# EAGLE design Pico Gamepad (EAGLE 9.3.0)
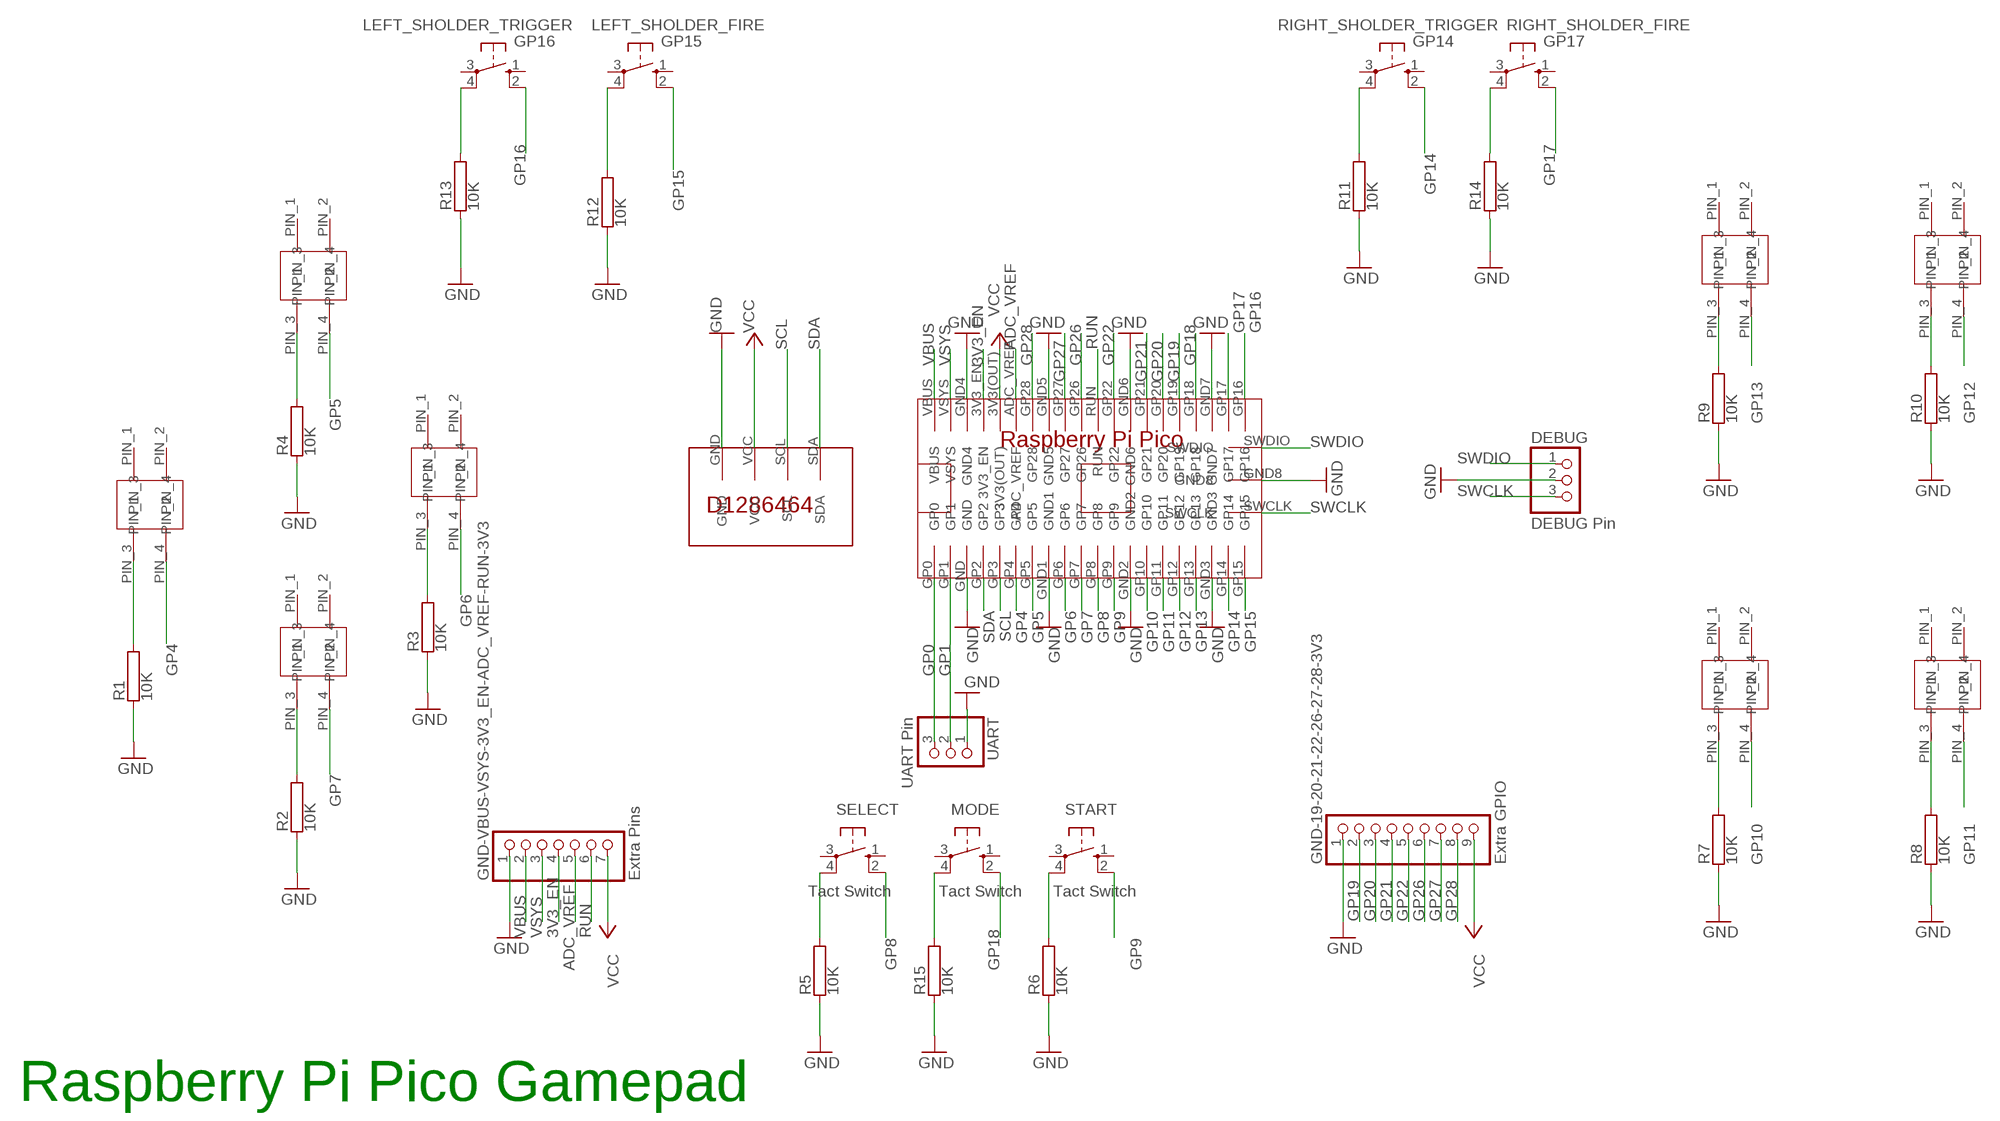
[diagram p0: schematic, sheet 1]

## Parts
A  GAMEPAD_BTN  [GAMEPAD_BTN]
B  GAMEPAD_BTN  [GAMEPAD_BTN]
DEBUG  DEBUG Pin  PINHD-1X3  [1X03]
DOWN  GAMEPAD_BTN  [GAMEPAD_BTN]
GND-19-20-21-22-26-27-28-3V3  Extra GPIO  PINHD-1X9  [1X09]
GND-VBUS-VSYS-3V3_EN-ADC_VREF-RUN-3V3  Extra Pins  PINHD-1X7  [1X07]
LEFT  GAMEPAD_BTN  [GAMEPAD_BTN]
LEFT_SHOLDER_FIRE  GP15  10-XX  [B3F-10XX]
LEFT_SHOLDER_TRIGGER  GP16  10-XX  [B3F-10XX]
MODE  Tact Switch  10-XX  [B3F-10XX]
R1  10K  RRS1/8  [RS1/8]
R2  10K  RRS1/8  [RS1/8]
R3  10K  RRS1/8  [RS1/8]
R4  10K  RRS1/8  [RS1/8]
R5  10K  RRS1/8  [RS1/8]
R6  10K  RRS1/8  [RS1/8]
R7  10K  RRS1/8  [RS1/8]
R8  10K  RRS1/8  [RS1/8]
R9  10K  RRS1/8  [RS1/8]
R10  10K  RRS1/8  [RS1/8]
R11  10K  RRS1/8  [RS1/8]
R12  10K  RRS1/8  [RS1/8]
R13  10K  RRS1/8  [RS1/8]
R14  10K  RRS1/8  [RS1/8]
R15  10K  RRS1/8  [RS1/8]
RIGHT  GAMEPAD_BTN  [GAMEPAD_BTN]
RIGHT_SHOLDER_FIRE  GP17  10-XX  [B3F-10XX]
RIGHT_SHOLDER_TRIGGER  GP14  10-XX  [B3F-10XX]
SELECT  Tact Switch  10-XX  [B3F-10XX]
START  Tact Switch  10-XX  [B3F-10XX]
U$1  RASPBERRYPIPICO  [RASPBERRYPIPICO]
U$2  OLED_DISPLAY  [OLED_DISPLAY]
UART  UART Pin  PINHD-1X3  [1X03]
UP  GAMEPAD_BTN  [GAMEPAD_BTN]
X  GAMEPAD_BTN  [GAMEPAD_BTN]
Y  GAMEPAD_BTN  [GAMEPAD_BTN]

## Nets
3V3_EN: GND-VBUS-VSYS-3V3_EN-ADC_VREF-RUN-3V3.4 U$1.3V3_EN
ADC_VREF: GND-VBUS-VSYS-3V3_EN-ADC_VREF-RUN-3V3.5 U$1.ADC_VREF
GND: DEBUG.2 GND-19-20-21-22-26-27-28-3V3.1 GND-VBUS-VSYS-3V3_EN-ADC_VREF-RUN-3V3.1 R1.1 R2.1 R3.1 R4.1 R5.1 R6.1 R7.1 R8.1 R9.1 R10.1 R11.1 R12.1 R13.1 R14.1 R15.1 U$1.GND U$1.GND1 U$1.GND2 U$1.GND3 U$1.GND4 U$1.GND5 U$1.GND6 U$1.GND7 U$1.GND8 U$2.GND UART.1
GP0: U$1.GP0 UART.3
GP1: U$1.GP1 UART.2
GP4: LEFT.PIN_4 U$1.GP4
GP5: U$1.GP5 UP.PIN_4
GP6: RIGHT.PIN_4 U$1.GP6
GP7: DOWN.PIN_4 U$1.GP7
GP8: SELECT.2(S1) U$1.GP8
GP9: START.2(S1) U$1.GP9
GP10: A.PIN_4 U$1.GP10
GP11: B.PIN_4 U$1.GP11
GP12: U$1.GP12 Y.PIN_4
GP13: U$1.GP13 X.PIN_4
GP14: RIGHT_SHOLDER_TRIGGER.2(S1) U$1.GP14
GP15: LEFT_SHOLDER_FIRE.2(S1) U$1.GP15
GP16: LEFT_SHOLDER_TRIGGER.2(S1) U$1.GP16
GP17: RIGHT_SHOLDER_FIRE.2(S1) U$1.GP17
GP18: MODE.2(S1) U$1.GP18
GP19: GND-19-20-21-22-26-27-28-3V3.2 U$1.GP19
GP20: GND-19-20-21-22-26-27-28-3V3.3 U$1.GP20
GP21: GND-19-20-21-22-26-27-28-3V3.4 U$1.GP21
GP22: GND-19-20-21-22-26-27-28-3V3.5 U$1.GP22
GP26: GND-19-20-21-22-26-27-28-3V3.6 U$1.GP26
GP27: GND-19-20-21-22-26-27-28-3V3.7 U$1.GP27
GP28: GND-19-20-21-22-26-27-28-3V3.8 U$1.GP28
N$1: R9.2 X.PIN_3
N$2: R10.2 Y.PIN_3
N$3: R11.2 RIGHT_SHOLDER_TRIGGER.4(P1)
N$4: LEFT_SHOLDER_FIRE.4(P1) R12.2
N$5: R4.2 UP.PIN_3
N$6: LEFT.PIN_3 R1.2
N$7: DOWN.PIN_3 R2.2
N$8: R3.2 RIGHT.PIN_3
N$9: MODE.4(P1) R15.2
N$10: R5.2 SELECT.4(P1)
N$11: R6.2 START.4(P1)
N$12: A.PIN_3 R7.2
N$13: B.PIN_3 R8.2
N$14: LEFT_SHOLDER_TRIGGER.4(P1) R13.2
N$16: R14.2 RIGHT_SHOLDER_FIRE.4(P1)
RUN: GND-VBUS-VSYS-3V3_EN-ADC_VREF-RUN-3V3.6 U$1.RUN
SCL: U$1.GP3 U$2.SCL
SDA: U$1.GP2 U$2.SDA
SWCLK: DEBUG.3 U$1.SWCLK
SWDIO: DEBUG.1 U$1.SWDIO
VBUS: GND-VBUS-VSYS-3V3_EN-ADC_VREF-RUN-3V3.2 U$1.VBUS
VCC: GND-19-20-21-22-26-27-28-3V3.9 GND-VBUS-VSYS-3V3_EN-ADC_VREF-RUN-3V3.7 U$1.3V3(OUT) U$2.VCC
VSYS: GND-VBUS-VSYS-3V3_EN-ADC_VREF-RUN-3V3.3 U$1.VSYS
Unconnected: A.PIN_1 A.PIN_2 B.PIN_1 B.PIN_2 DOWN.PIN_1 DOWN.PIN_2 LEFT.PIN_1 LEFT.PIN_2 LEFT_SHOLDER_FIRE.1(S) LEFT_SHOLDER_FIRE.3(P) LEFT_SHOLDER_TRIGGER.1(S) LEFT_SHOLDER_TRIGGER.3(P) MODE.1(S) MODE.3(P) RIGHT.PIN_1 RIGHT.PIN_2 RIGHT_SHOLDER_FIRE.1(S) RIGHT_SHOLDER_FIRE.3(P) RIGHT_SHOLDER_TRIGGER.1(S) RIGHT_SHOLDER_TRIGGER.3(P) SELECT.1(S) SELECT.3(P) START.1(S) START.3(P) UP.PIN_1 UP.PIN_2 X.PIN_1 X.PIN_2 Y.PIN_1 Y.PIN_2

## Notes on the sheet
- Raspberry Pi Pico Gamepad

## Library data of the parts
A B DOWN LEFT RIGHT UP X Y = gamepad_btn:GAMEPAD_BTN
DEBUG UART = pinhead:PINHD-1X3: PIN HEADER
GND-19-20-21-22-26-27-28-3V3 = pinhead:PINHD-1X9: PIN HEADER
GND-VBUS-VSYS-3V3_EN-ADC_VREF-RUN-3V3 = pinhead:PINHD-1X7: PIN HEADER
LEFT_SHOLDER_FIRE LEFT_SHOLDER_TRIGGER MODE RIGHT_SHOLDER_FIRE RIGHT_SHOLDER_TRIGGER SELECT START = switch-omron:10-XX: OMRON SWITCH; MPN: B3F-1000; OC_FARNELL: 176432; OC_NEWARK: 36M3542
R1-R15 = resistor-power:R: Power Resitor; OC_FARNELL: unknown; OC_NEWARK: unknown
U$1 = raspberrypi_pico:RASPBERRYPIPICO
U$2 = oled_display:OLED_DISPLAY

## Board
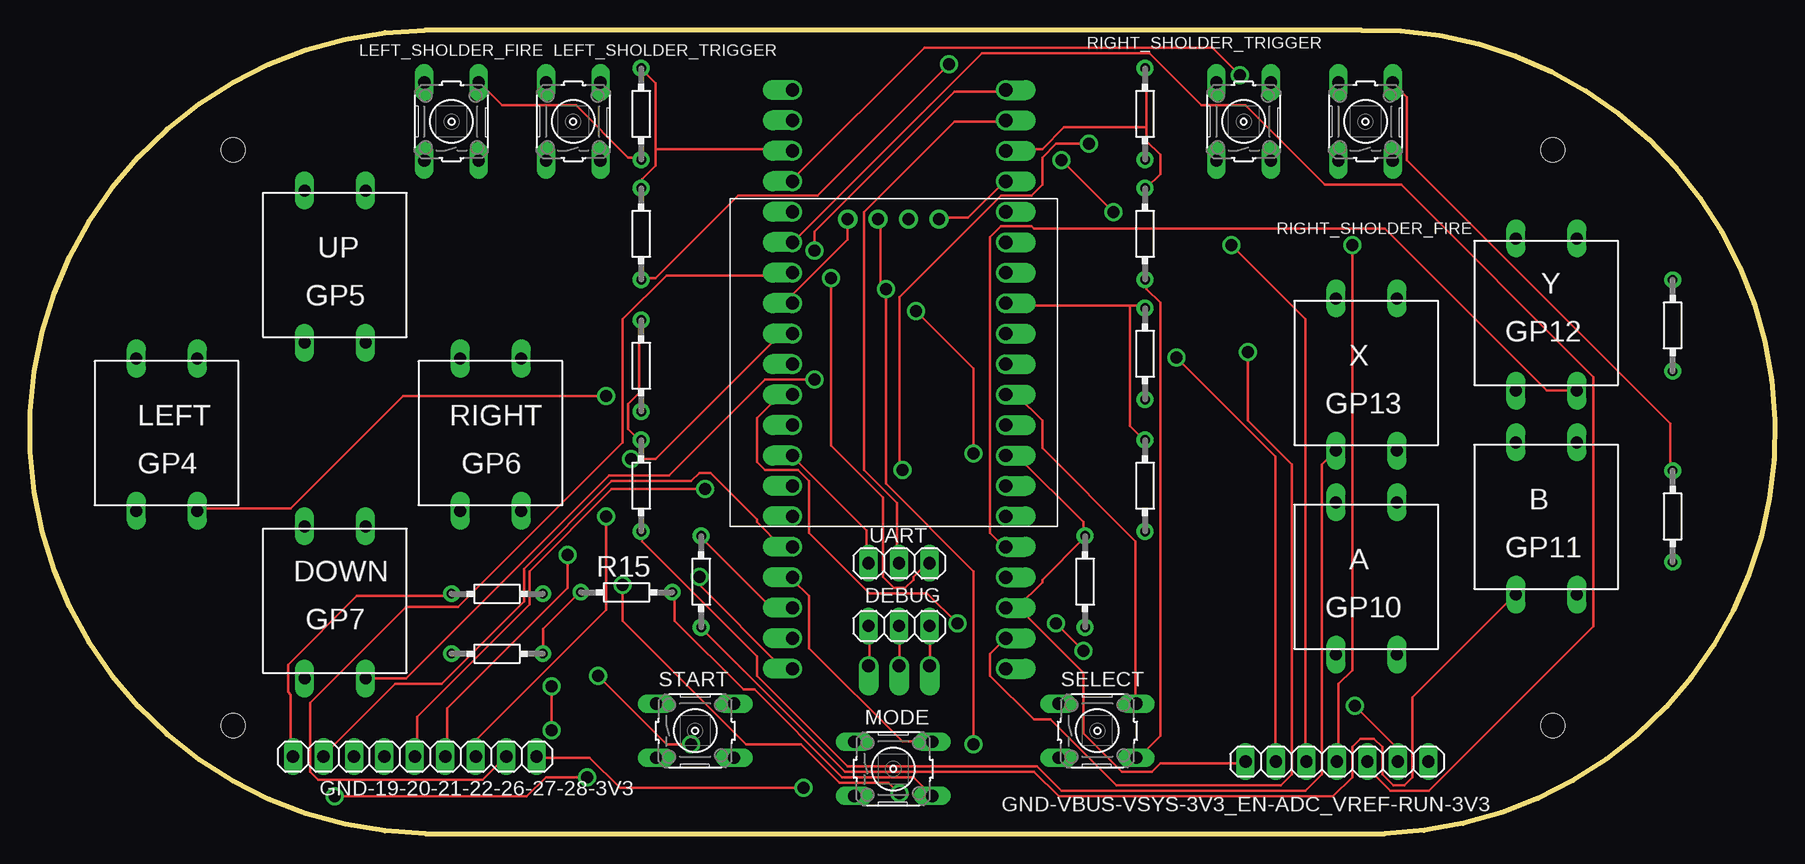
[diagram p1: board, top side]
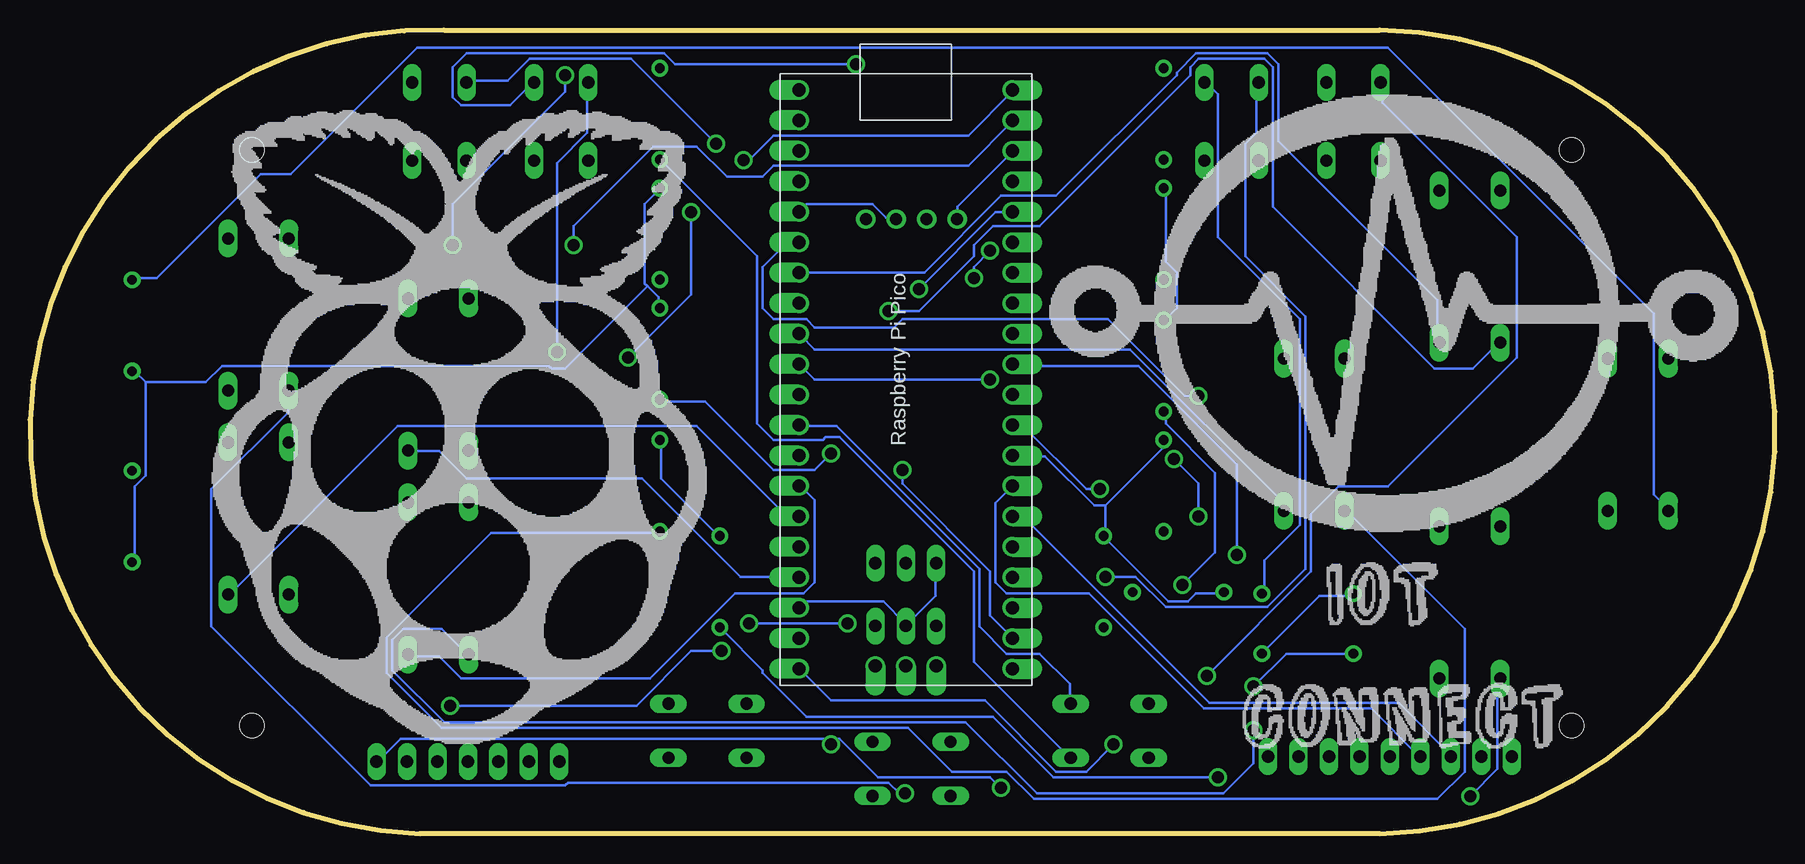
[diagram p2: board, bottom side, seen from below]

Size 145.45 x 67 mm. Coordinates in mm from the lower left corner, seen from the top.
Outline: 32.95,0 112.95,0 arc180 110.95,67 32.95,67 arc178 32.95,0
Copper layers (1*16): Top 0.035mm / dielectric 1.5mm / Bottom 0.035mm
Design rules "default *": minimum track width 8mil, minimum drill 1mm, track to track 10mil, track to pad 10mil, pad to pad 10mil, via to via 12mil, smd to smd 6mil, copper to edge 40mil, drill to drill 12mil, minimum pad ring 10mil, minimum via ring 8mil, stop-mask expansion 4mil, vias tented up to drill 0mil, thermal gap 10mil
Holes 2 mm at 126.95,57 16.95,57 16.95,9 126.95,9

### Footprints (pad centres in the part's own frame; a part is rotated, then mirrored left to right if it is on the bottom)
GAMEPAD_BTN = drill 1 pad 1.6 long: PIN_1 -2.08,7.62; PIN_2 3,7.62; PIN_3 -2.08,-5.08; PIN_4 3,-5.08
1X03 = drill 1.016 long: 1 -2.54,0; 2 0,0; 3 2.54,0
1X09 = drill 1.016 long: 1 -10.16,0; 2 -7.62,0; 3 -5.08,0; 4 -2.54,0; 5 0,0; 6 2.54,0; 7 5.08,0; 8 7.62,0; 9 10.16,0
1X07 = drill 1.016 long: 1 -7.62,0; 2 -5.08,0; 3 -2.54,0; 4 0,0; 5 2.54,0; 6 5.08,0; 7 7.62,0
B3F-10XX = drill 1.016 long: 1 -3.251,2.261; 2 3.251,2.261; 3 -3.251,-2.261; 4 3.251,-2.261
RS1/8 = drill 0.8 pad 1.4: 1 -3.81,0; 2 3.81,0
RASPBERRYPIPICO = drill 1.1 pad 1.6 offset: 3V3(OUT) 10.16,17.78; 3V3_EN 7.62,17.78; ADC_VREF 12.7,17.78; GND 5.08,0; GND1 17.78,0; GND2 30.48,0; GND3 43.18,0; GND4 5.08,17.78; GND5 17.78,17.78; GND6 30.48,17.78; GND7 43.18,17.78; GND8 48.03,8.89; GP0 0,0; GP1 2.54,0; GP2 7.62,0; GP3 10.16,0; GP4 12.7,0; GP5 15.24,0; GP6 20.32,0; GP7 22.86,0; GP8 25.4,0; GP9 27.94,0; GP10 33.02,0; GP11 35.56,0; GP12 38.1,0; GP13 40.64,0; GP14 45.72,0; GP15 48.26,0; GP16 48.26,17.78; GP17 45.72,17.78; GP18 40.64,17.78; GP19 38.1,17.78; GP20 35.56,17.78; GP21 33.02,17.78; GP22 27.94,17.78; GP26 22.86,17.78; GP27 20.32,17.78; GP28 15.24,17.78; RUN 25.4,17.78; SWCLK 48.03,6.35; SWDIO 48.03,11.43; VBUS 0,17.78; VSYS 2.54,17.78
OLED_DISPLAY = drill 1.001 pad 1.6: GND -3.8,12.2; SCL 1.28,12.2; SDA 3.82,12.2; VCC -1.26,12.2

### Placement (x,y rotation side)
A  110.95,20 0 top
B  125.95,25 0 top
DEBUG  72.45,17.3 0 top
DOWN  24.97,18 0 top
GND-19-20-21-22-26-27-28-3V3  32.08,6.41 0 top
GND-VBUS-VSYS-3V3_EN-ADC_VREF-RUN-3V3  108.95,6 0 top
LEFT  10.95,31.99 0 top
LEFT_SHOLDER_FIRE  35.13,59.37 90 top
LEFT_SHOLDER_TRIGGER  45.29,59.37 90 top
MODE  71.96,5.39 0 top
R1  136.93,42.36 90 top
R2  87.95,21 270 top
R3  92.95,29 270 top
R4  92.95,40 270 top
R5  92.95,50 270 top
R6  92.95,60 270 top
R7  38.95,15 180 top
R8  55.95,21 270 top
R9  50.95,29 270 top
R10  50.95,39 270 top
R11  50.95,50 270 top
R12  50.95,60 270 top
R13  38.95,20 0 top
R14  136.93,26.44 90 top
R15  49.73,20.12 0 top
RIGHT  37.95,31.99 0 top
RIGHT_SHOLDER_FIRE  111.33,59.37 90 top
RIGHT_SHOLDER_TRIGGER  101.17,59.37 90 top
SELECT  88.98,8.57 0 top
START  55.45,8.57 0 top
U$1  81.34,62 270 bottom
U$2  71.96,39.02 0 top
UART  72.45,22.54 0 top
UP  24.97,46 0 top
X  110.95,37 0 top
Y  125.95,42 0 top

### Tracks (layer width: path | path; a pad name or v marks a point on that pad's centre or on a via)
3V3_EN  (via drill 1)
  Top 0.203: v110.21,49.06 110.21,13.62 109.07,12.48 109.07,6.08 GND-VBUS-VSYS-3V3_EN-ADC_VREF-RUN-3V3.4 | v100.84,63.23 98.55,65.51 74.55,65.51 63.58,54.54 U$1.3V3_EN
  Bottom 0.203: v110.21,49.06 110.21,52.48 100.84,61.86 v100.84,63.23
ADC_VREF
  Top 0.203: GND-VBUS-VSYS-3V3_EN-ADC_VREF-RUN-3V3.5 111.58,5.85 111.58,5.39 113.41,3.56 116.61,3.56 130.33,17.28 130.33,38.08 114.33,54.08 107.92,54.08 101.3,60.71 97.64,60.71 93.29,65.06 79.35,65.06 63.58,49.28 U$1.ADC_VREF
GND
  Top 0.203: 93.07,58.88 93.07,57.74 94.21,56.6 94.21,55 93.07,53.86 R5.1 | 93.07,58.88 93.07,63.69 R6.1 | 91.69,44.03 92.84,44.03 R4.1 | 91.69,44.03 81.41,44.03 U$1.GND1 | 93.07,58.88 86.21,58.88 84.38,57.06 81.41,57.06 U$1.GND | R7.1 42.77,15.22 42.77,17.05 45.75,20.02 R15.1 | GND-19-20-21-22-26-27-28-3V3.1 21.74,6.54 21.74,11.56 21.51,11.79 21.51,14.08 27.23,19.79 35,19.79 R13.1 | 52.15,57.06 52.15,62.54 51,63.69 R12.1 | 52.15,57.06 52.15,55.68 51,54.54 51,53.86 R11.1 | U$1.GND5 63.58,44.25 63.58,44.94 68.15,49.51 68.15,51.11 U$2.GND | 52.15,57.06 63.35,57.06 U$1.GND4 | R10.1 50.77,42.65 50.77,36.71 49.86,35.8 49.86,33.74 50.77,32.82 R9.1 | U$1.GND7 63.35,18.88 61.75,18.88 56.03,24.59 R8.1 | DEBUG.2 72.49,17.28 72.49,14.08 U$1.GND8 | 82.32,18.88 84.38,20.94 84.38,21.17 87.81,24.59 R2.1 87.81,24.82 87.81,25.97 82.32,31.45 81.41,31.45 U$1.GND2 | 82.32,18.88 81.41,18.88 U$1.GND3 82.32,18.88 | 82.32,18.88 87.81,13.39 87.81,8.36 91.01,5.16 93.52,5.16 94.21,5.85 101.3,5.85 GND-VBUS-VSYS-3V3_EN-ADC_VREF-RUN-3V3.1 | U$1.GND6 63.58,31.45 69.75,25.28 69.75,22.54 UART.1 | 91.69,44.03 91.69,33.97 92.84,32.82 R3.1
  Bottom 0.203: 135.81,37.63 135.81,29.85 136.73,28.94 136.73,22.77 R14.1 | 135.81,37.63 136.73,38.54 R1.1 | 93.98,45.63 94.21,45.85 94.21,52.48 93.07,53.63 R5.1 | 93.98,45.63 93.07,44.71 93.07,44.03 R4.1 | 135.81,37.63 130.78,37.63 129.41,39 102.21,39 101.98,38.77 100.84,38.77 93.98,45.63 | R13.1 35.23,19.79 37.97,19.79 42.55,15.22 R7.1 | U$2.GND 68.15,51.34 68.15,52.26 63.58,56.83 U$1.GND4 | 55.8,27.34 55.8,24.82 R8.1 55.8,24.59 50.55,19.34 48.95,19.34 48.26,20.02 45.97,20.02 R15.1 | 55.8,27.34 51,32.14 51,32.6 R9.1 | 55.8,27.34 56.72,27.34 60.83,31.45 63.35,31.45 U$1.GND6 | UART.1 69.98,22.54 69.98,19.79 72.26,17.51 DEBUG.2 72.49,17.51 74.32,19.34 80.72,19.34 81.18,18.88 U$1.GND3 | R3.1 92.84,32.6 92.84,29.62 88.04,24.82 R2.1 | R11.1 50.77,53.63 50.77,47.68 49.86,46.77 49.86,43.8 50.77,42.88 R10.1
GP0  (via drill 1)
  Top 0.203: v66.78,46.31 66.78,32.37 71.12,28.02 71.12,21.39 72.03,20.48 72.95,20.48 73.63,21.17 73.63,21.39 74.78,22.54 UART.3 | v65.41,48.6 65.41,50.2 77.06,61.86 81.18,61.86 U$1.GP0
  Bottom 0.203: v66.78,46.31 66.78,47.23 v65.41,48.6
GP1
  Top 0.203: UART.2 72.26,22.54 72.26,27.57 69.52,30.31 69.52,51.8 77.06,59.34 81.18,59.34 U$1.GP1
GP4  (via drill 1)
  Top 0.203: v48.03,36.48 31.12,36.48 21.74,27.11 13.97,27.11 LEFT.PIN_4
  Bottom 0.203: v48.03,36.48 49.17,36.48 55.58,42.88 72.72,42.88 73.41,42.2 80.04,42.2 80.72,42.88 83.46,42.88 84.38,43.8 84.38,47.23 82.32,49.28 81.41,49.28 U$1.GP4
GP5
  Bottom 0.203: UP.PIN_4 28.14,41.05 28.14,44.48 41.4,57.74 41.4,64.14 42.32,65.06 48.26,65.06 49.86,63.46 49.86,63.23 59.92,53.17 64.49,53.17 70.89,46.77 81.18,46.77 U$1.GP5
GP6
  Bottom 0.203: RIGHT.PIN_4 41.17,27.11 41.17,27.8 53.75,40.37 80.04,40.37 81.18,41.51 U$1.GP6
GP7  (via drill 1)
  Top 0.203: v65.41,37.85 61.29,37.85 53.29,29.85 48.26,29.85 31.34,12.94 28.14,12.94 DOWN.PIN_4
  Bottom 0.203: v65.41,37.85 80.04,37.85 81.18,39 U$1.GP7
GP8
  Top 0.203: SELECT.2 92.15,10.88 92.15,24.37 84.38,32.14 84.38,34.42 82.32,36.48 81.41,36.48 U$1.GP8
GP9
  Bottom 0.203: START.2 58.78,10.88 58.78,12.48 61.29,14.99 64.03,14.99 66.32,17.28 66.32,22.08 78.21,33.97 81.18,33.97 U$1.GP9
GP10
  Bottom 0.203: A.PIN_4 113.87,14.77 111.35,14.77 109.53,12.94 93.75,12.94 86.67,20.02 80.95,20.02 80.04,20.94 80.04,27.8 81.18,28.94 U$1.GP10
GP11
  Bottom 0.203: B.PIN_4 128.73,20.02 114.78,33.97 89.87,33.97 82.55,26.65 81.41,26.65 U$1.GP11
GP12
  Top 0.203: Y.PIN_4 128.73,36.94 126.44,36.94 112.95,50.43 83.69,50.43 83.46,50.66 80.95,50.66 80.04,49.74 80.04,25.05 81.18,23.91 U$1.GP12
GP13
  Bottom 0.203: X.PIN_4 113.87,31.91 111.35,31.91 109.07,29.62 94.44,29.62 86.21,21.39 81.41,21.39 U$1.GP13
GP14  (via drill 1)
  Top 0.203: v101.52,40.14 101.52,34.42 105.18,30.77 105.18,4.94 104.27,4.02 90.55,4.02 85.06,9.51 83.69,9.51 80.04,13.16 80.04,14.99 81.18,16.14 U$1.GP14
  Bottom 0.203: v101.52,40.14 101.52,55.91 99.01,58.43 99.01,62.54 RIGHT_SHOLDER_TRIGGER.2
GP15  (via drill 1)
  Top 0.203: v47.35,13.16 53.06,7.45 v55.12,7.45
  Bottom 0.203: v47.35,13.16 38.66,21.85 38.66,26.65 36.37,28.94 32.26,28.94 21.51,39.68 21.51,49.74 32.72,60.94 32.72,62.54 LEFT_SHOLDER_FIRE.2 | v55.12,7.45 57.4,5.16 59.92,5.16 65.86,11.11 78.66,11.11 81.18,13.62 U$1.GP15
GP16  (via drill 1)
  Top 0.203: v55.8,21.39 55.8,20.71 62.66,13.85 63.35,13.85 U$1.GP16
  Bottom 0.203: v55.8,21.39 53.29,21.39 50.77,18.88 42.32,18.88 39.12,22.08 39.12,43.11 44.15,48.14 44.15,57.51 43.23,58.43 43.23,62.54 LEFT_SHOLDER_TRIGGER.2
GP17  (via drill 1)
  Top 0.203: v88.27,57.51 85.52,57.51 84.38,56.37 84.38,54.08 83.46,53.17 80.95,53.17 72.49,44.71 72.49,30.54 v72.72,30.31
  Bottom 0.203: v88.27,57.51 95.35,64.6 103.81,64.6 105.64,62.77 109.07,62.77 RIGHT_SHOLDER_FIRE.2 | v72.72,30.31 72.72,29.17 65.41,21.85 65.41,18.19 63.58,16.37 U$1.GP17
GP18
  Top 0.203: MODE.2 75.01,7.68 72.72,7.68 64.95,15.45 64.95,19.79 63.58,21.17 U$1.GP18
GP19
  Top 0.203: GND-19-20-21-22-26-27-28-3V3.2 24.49,6.54 30.43,12.48 34.32,12.48 41.17,19.34 41.17,22.08 48.49,29.4 55.12,29.4 55.8,30.08 56.72,30.08 60.6,26.2 60.6,25.97 62.66,23.91 63.35,23.91 U$1.GP19
GP20
  Bottom 0.203: GND-19-20-21-22-26-27-28-3V3.3 27,6.54 31.34,10.88 47.12,10.88 62.66,26.42 63.35,26.42 U$1.GP20
GP21
  Bottom 0.203: GND-19-20-21-22-26-27-28-3V3.4 29.74,6.54 33.63,10.42 47.57,10.42 57.18,20.02 64.03,20.02 64.95,20.94 64.95,27.57 63.58,28.94 U$1.GP21
GP22  (via drill 1)
  Top 0.203: v56.26,28.71 48.49,28.71 41.63,21.85 41.63,19.11 32.26,9.74 32.26,6.54 GND-19-20-21-22-26-27-28-3V3.5
  Bottom 0.203: v56.26,28.71 57.4,28.71 62.66,33.97 63.35,33.97 U$1.GP22
GP26  (via drill 1)
  Top 0.203: v44.83,23.22 44.83,20.48 34.77,10.42 34.77,6.54 GND-19-20-21-22-26-27-28-3V3.6
  Bottom 0.203: v44.83,23.22 44.83,30.77 53.06,39 63.35,39 U$1.GP26
GP27  (via drill 1)
  Top 0.203: v48.03,26.42 48.03,18.65 37.29,7.91 37.29,6.54 GND-19-20-21-22-26-27-28-3V3.7 | v50.09,31.22 52.15,31.22 62.43,41.51 63.35,41.51 U$1.GP27
  Bottom 0.203: v48.03,26.42 48.03,29.17 v50.09,31.22
GP28
  Top 0.203: GND-19-20-21-22-26-27-28-3V3.8 39.57,6.31 37.74,4.48 24.03,4.48 23.34,5.16 23.34,10.88 31.34,18.88 35.69,18.88 49.4,32.6 49.4,42.88 53.06,46.54 63.35,46.54 U$1.GP28
N$1
  Top 0.203: R9.2 51,25.05 51,24.37 60.6,14.77 60.6,13.16 68.15,5.62 83.92,5.62 85.98,3.56 106.32,3.56 107.7,4.94 107.7,30.77 108.84,31.91 X.PIN_3
N$2  (via drill 1)
  Top 0.203: v49.4,20.71 49.4,17.74 59.69,7.45 64.26,7.45 67.46,4.25 71.58,4.25 v72.49,3.34
  Bottom 0.203: v49.4,20.71 46.66,23.45 46.66,30.08 50.77,34.2 50.77,35.11 R10.2 | v72.49,3.34 72.95,3.34 73.86,4.25 100.61,4.25 100.84,4.02 117.07,4.02 130.33,17.28 130.33,28.71 123.93,35.11 123.93,36.71 Y.PIN_3
N$3  (via drill 1)
  Top 0.203: v76.61,64.14 65.63,53.17 59,53.17 52.15,46.31 51,46.31 R11.2
  Bottom 0.203: v76.61,64.14 91.69,64.14 92.61,65.06 109.07,65.06 110.21,63.91 110.21,61.4 109.53,60.71 105.41,60.71 103.58,62.54 RIGHT_SHOLDER_TRIGGER.4
N$4
  Top 0.203: R12.2 50.77,56.37 49.86,56.37 45.52,60.71 39.34,60.71 37.52,62.54 LEFT_SHOLDER_FIRE.4
N$5  (via drill 1)
  Top 0.203: v78.66,31.68 78.66,38.77 v73.86,43.57
  Bottom 0.203: v78.66,31.68 80.04,30.31 83.46,30.31 89.18,36.02 92.84,36.02 R4.2 | v73.86,43.57 71.35,43.57 66.78,48.14 66.78,49.06 65.18,50.66 61.29,50.66 48.72,63.23 48.72,63.91 48.03,64.6 42.55,64.6 41.86,63.91 41.86,52.26 28.37,38.77 25.17,38.77 23.11,40.83 UP.PIN_3
N$6
  Bottom 0.203: R1.2 136.73,46.31 134.9,46.31 126.21,55 123.7,55 113.18,65.51 32.26,65.51 10.08,43.34 10.08,28.25 8.94,27.11 LEFT.PIN_3
N$7  (via drill 1)
  Top 0.203: v46.43,4.71 43,4.71 41.4,3.11 v25.4,3.11
  Bottom 0.203: v46.43,4.71 60.15,4.71 65.18,9.74 80.72,9.74 84.38,13.39 84.38,13.62 87.81,17.05 R2.2 | v25.4,3.11 23.11,5.39 23.11,12.71 DOWN.PIN_3
N$8
  Bottom 0.203: R3.2 93.07,25.05 107.01,25.05 115.7,16.37 115.7,13.39 111.13,8.82 72.26,8.82 68.61,5.16 64.03,5.16 61.75,2.88 28.14,2.88 25.86,5.16 25.86,17.05 35.69,26.88 RIGHT.PIN_3
N$9
  Top 0.203: MODE.4 73.63,4.71 67.69,4.71 60.38,12.02 59.46,12.02 53.75,17.74 53.75,20.02 R15.2
N$10
  Top 0.203: R5.2 93.07,46.08 93.07,45.4 94.21,44.25 94.21,8.14 92.38,6.31 SELECT.4
N$11
  Bottom 0.203: R6.2 92.84,56.14 84.84,48.14 84.84,34.2 83.46,32.82 79.35,32.82 79.12,33.05 77.98,33.05 66.78,21.85 66.78,14.31 58.78,6.31 START.4
N$12  (via drill 1)
  Top 0.203: v43.46,8.59 v43.46,12.25
  Bottom 0.203: v43.46,12.25 40.72,14.99 35.23,14.99 R7.2 | v43.46,8.59 43.46,5.85 45.97,3.34 61.52,3.34 67.46,9.28 110.9,9.28 115.24,13.62 115.24,16.14 114.33,17.05 111.13,17.05 109.07,14.99 A.PIN_3
N$13
  Top 0.203: R8.2 56.03,17.05 67.92,5.16 83.69,5.16 85.75,3.11 108.61,3.11 110.21,4.71 110.21,7.22 110.9,7.91 112.04,7.91 112.73,7.22 112.73,4.94 113.64,4.02 114.55,4.02 115.24,4.71 115.24,11.34 123.7,19.79 B.PIN_3
N$14
  Bottom 0.203: R13.2 42.55,20.02 42.55,22.77 39.57,25.74 39.57,42.88 46.43,49.74 46.43,61.63 47.35,62.54 LEFT_SHOLDER_TRIGGER.4
N$16
  Top 0.203: R14.2 136.73,30.31 136.73,34.2 114.78,56.14 114.78,61.4 113.64,62.54 RIGHT_SHOLDER_FIRE.4
RUN  (via drill 1)
  Top 0.203: v110.44,10.65 113.87,7.22 113.87,6.08 GND-VBUS-VSYS-3V3_EN-ADC_VREF-RUN-3V3.6 | v85.52,17.51 v87.81,15.22 | v77.29,17.51 74.78,20.02 69.98,20.02 64.95,25.05 64.95,29.4 64.03,30.31 61.29,30.31 60.6,31 60.6,34.65 62.43,36.48 63.35,36.48 U$1.RUN
  Bottom 0.203: v110.44,10.65 94.89,10.65 90.32,15.22 v87.81,15.22 | v77.29,17.51 v85.52,17.51
SCL
  Bottom 0.203: U$2.SCL 73.41,51.34 74.09,51.34 75.24,52.48 80.72,52.48 81.18,52.03 U$1.GP3
SDA
  Top 0.203: U$2.SDA 75.92,51.34 78.21,51.34 81.18,54.31 U$1.GP2
SWCLK
  Top 0.203: DEBUG.3 75.01,17.28 75.01,14.08 U$1.SWCLK
SWDIO
  Top 0.203: DEBUG.1 69.98,17.28 69.98,14.08 U$1.SWDIO
VBUS  (via drill 1)
  Top 0.203: v95.58,39.68 103.81,31.45 103.81,6.08 GND-VBUS-VSYS-3V3_EN-ADC_VREF-RUN-3V3.2 | v85.98,56.14 v90.32,51.8
  Bottom 0.203: v95.58,39.68 90.32,44.94 v90.32,51.8 | v85.98,56.14 85.52,56.14 83.46,58.2 67.23,58.2 63.58,61.86 U$1.VBUS
VCC  (via drill 1)
  Top 0.203: U$2.VCC 70.89,51.11 70.89,45.85 v71.35,45.4 71.35,29.17 78.66,21.85 v78.66,7.45 | v64.49,3.79 49.17,3.79 46.66,6.31 42.32,6.31 GND-19-20-21-22-26-27-28-3V3.9
  Bottom 0.203: v71.35,45.4 64.95,51.8 63.58,51.8 U$1.3V3(OUT) | 78.66,7.91 77.98,7.91 74.78,4.71 65.41,4.71 v64.49,3.79 | 78.66,7.91 114.55,7.91 116.38,6.08 GND-VBUS-VSYS-3V3_EN-ADC_VREF-RUN-3V3.7 | 78.66,7.91 v78.66,7.45
VSYS  (via drill 1)
  Top 0.203: v100.15,49.06 106.32,42.88 106.32,6.08 GND-VBUS-VSYS-3V3_EN-ADC_VREF-RUN-3V3.3
  Bottom 0.203: v100.15,49.06 100.15,50.66 93.52,57.28 89.87,57.28 87.35,54.77 84.38,54.77 83.46,55.68 67.23,55.68 63.58,59.34 U$1.VSYS

### Text on the board
tPlace: UP | Y | X | LEFT | RIGHT | B | A | DOWN
tNames: GP5 | GP12 | GP13 | GP4 | GP6 | GP11 | GP10 | GP7